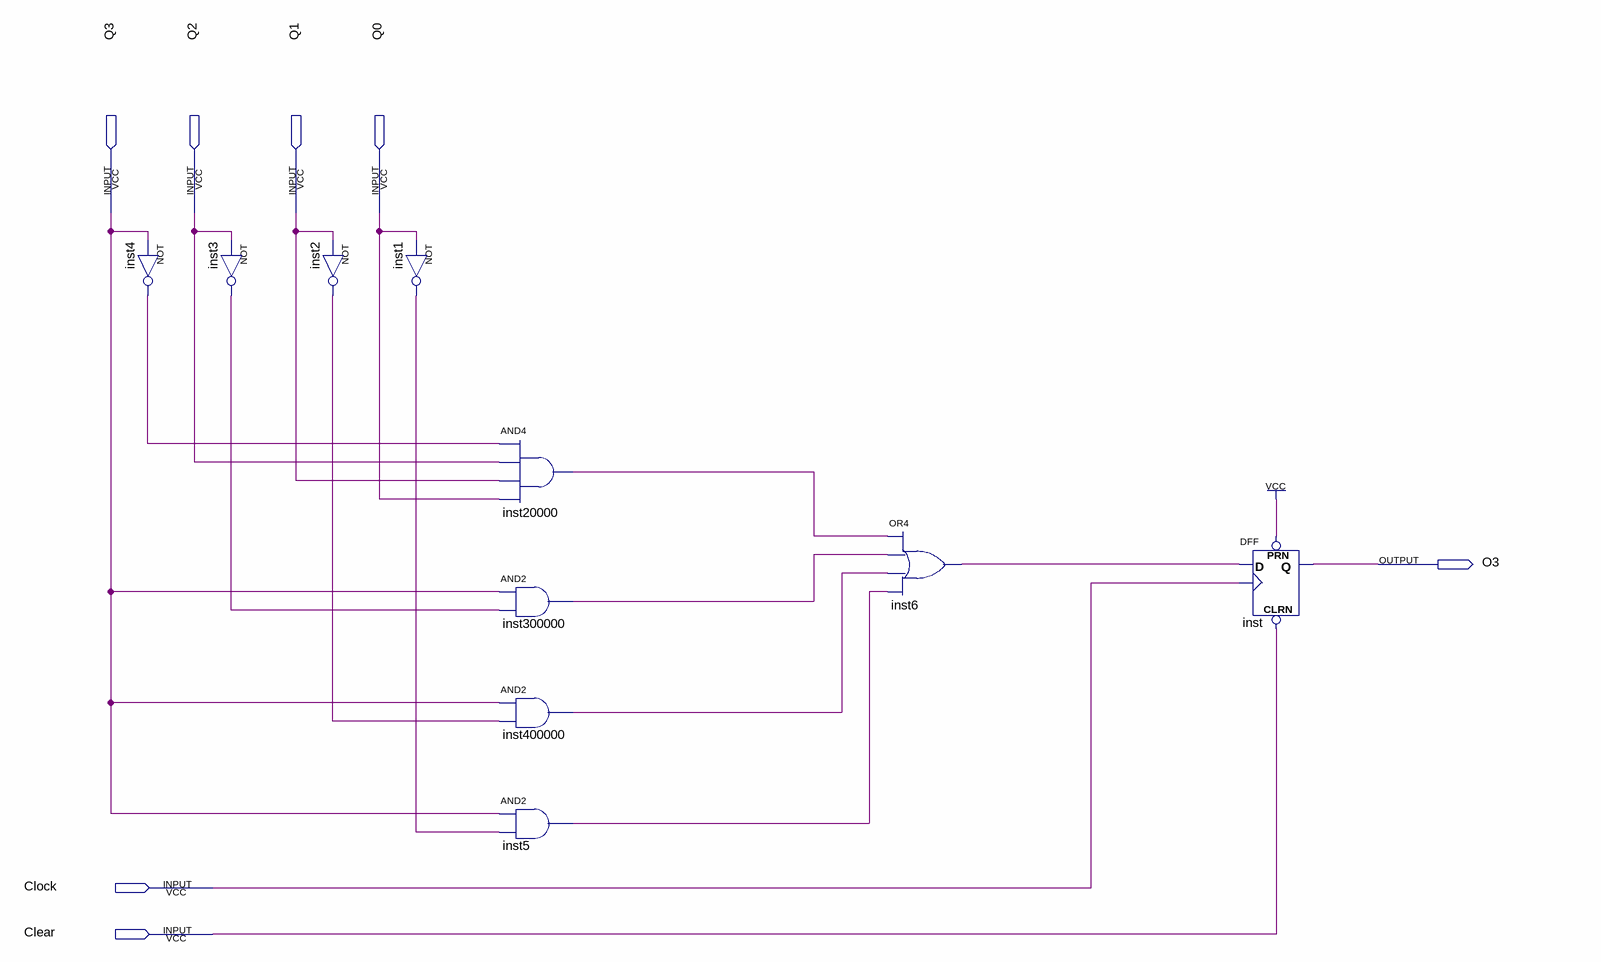
[diagram p0: schematic sheet]
// Quartus schematic D3.bdf as structural Verilog: 10 symbols, 7 pins
module D3 (
  input  Q3,
  input  Q2,
  input  Q1,
  input  Q0,
  input  Clock,
  input  Clear,
  output O3
);

  wire inst1_out, inst2_out, inst3_out, inst4_out, inst5_out, inst6_out, inst20000_out, inst300000_out,
       inst400000_out;

  not inst4 (inst4_out, Q3);
  not inst3 (inst3_out, Q2);
  not inst2 (inst2_out, Q1);
  not inst1 (inst1_out, Q0);
  and inst20000 (inst20000_out, inst4_out, Q2, Q1, Q0);
  and inst300000 (inst300000_out, Q3, inst3_out);
  and inst400000 (inst400000_out, Q3, inst2_out);
  and inst5 (inst5_out, Q3, inst1_out);
  or inst6 (inst6_out, inst20000_out, inst300000_out, inst400000_out, inst5_out);
  DFF inst (.CLRN(Clear), .CLK(Clock), .D(inst6_out), .PRN(1'b1), .Q(O3));
endmodule
